# EAGLE schematic Spresense_PLC _V1 (EAGLE 9.6.2)
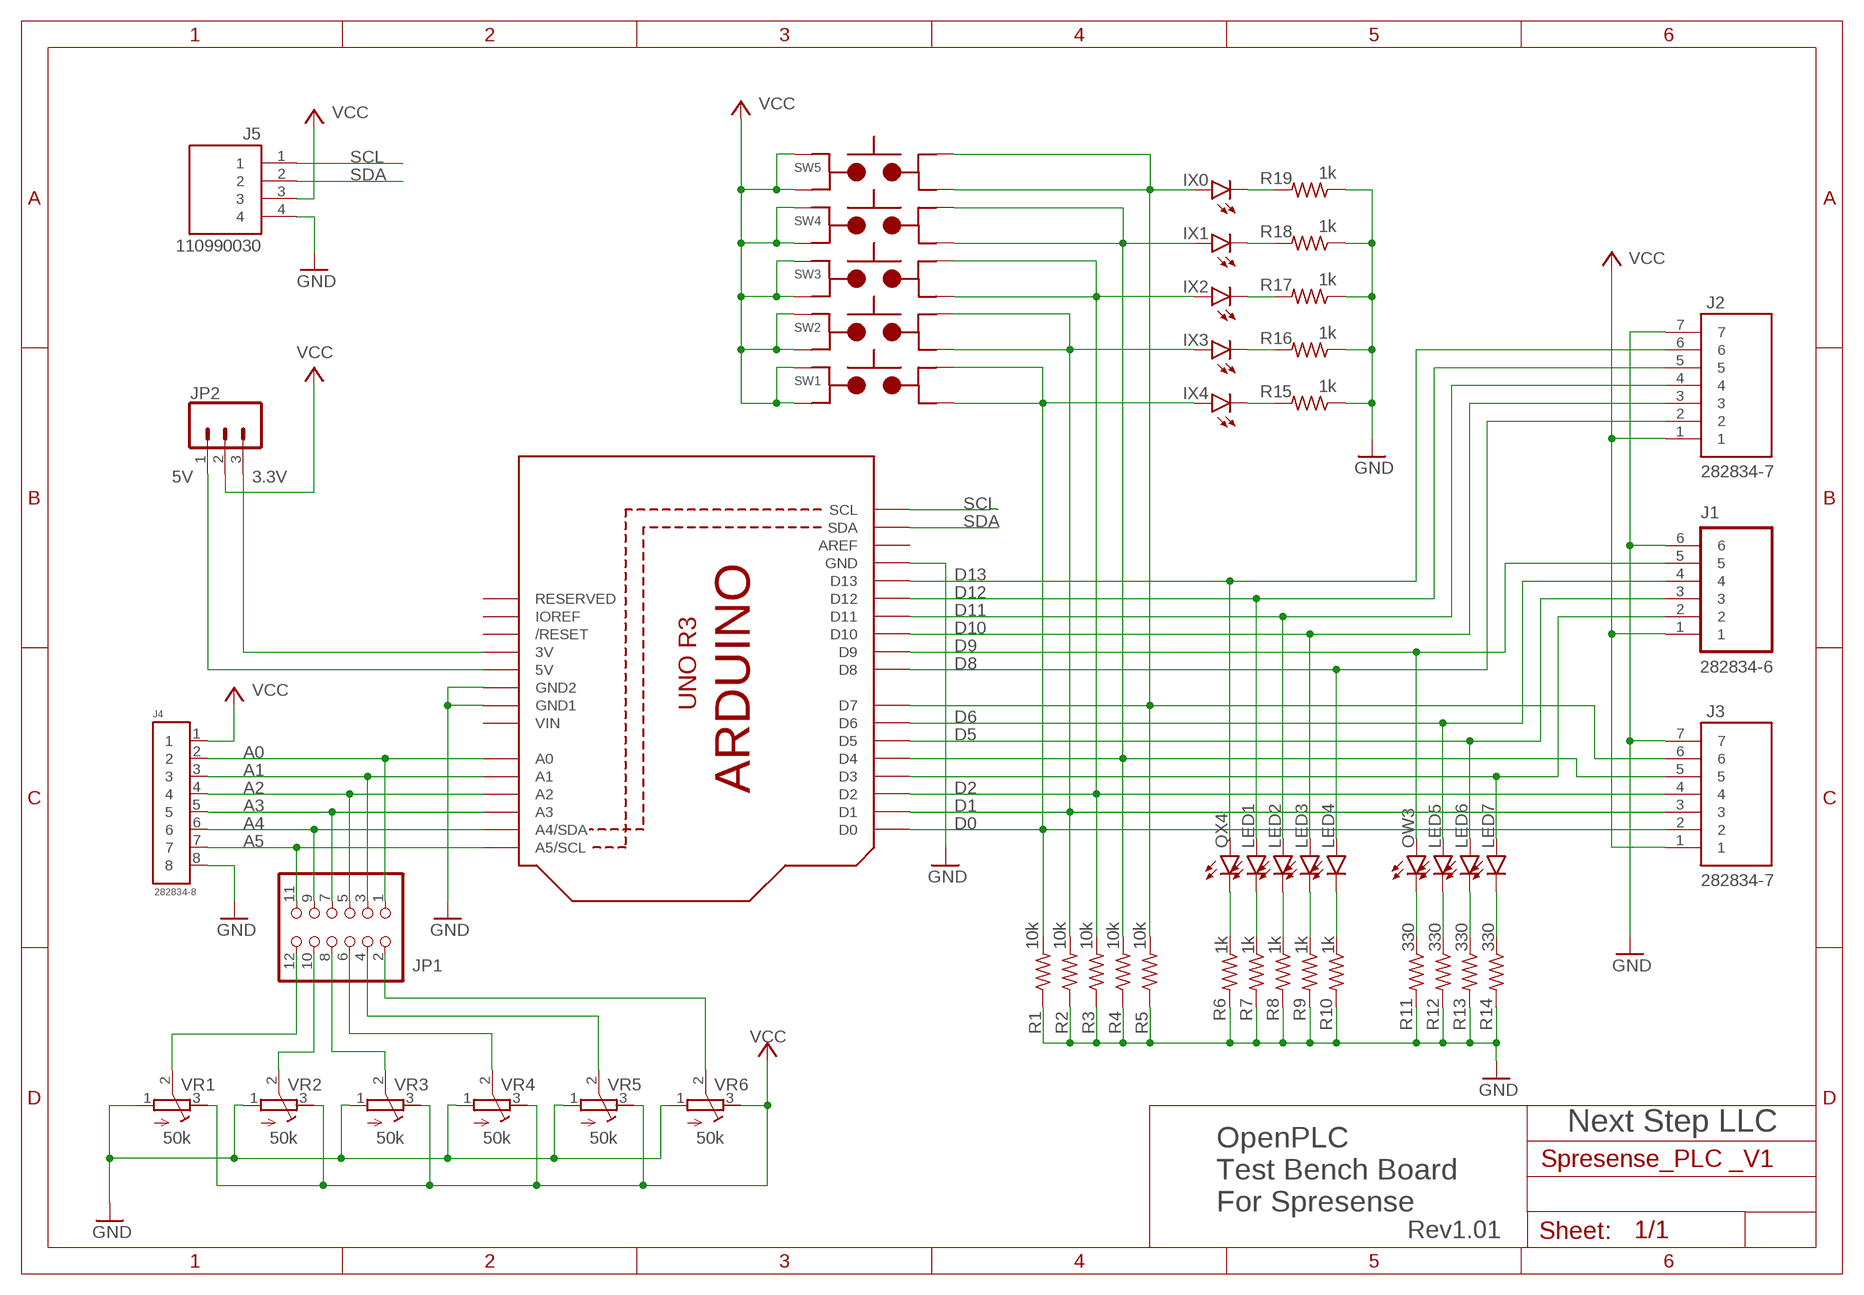
[diagram p0: schematic, sheet 1]

## Parts
IX0  LEDCHIP-LED0603  [CHIP-LED0603]
IX1  LEDCHIP-LED0603  [CHIP-LED0603]
IX2  LEDCHIP-LED0603  [CHIP-LED0603]
IX3  LEDCHIP-LED0603  [CHIP-LED0603]
IX4  LEDCHIP-LED0603  [CHIP-LED0603]
J1  282834-6  [TE_282834-6]
J2  282834-7  [TE_282834-7]
J3  282834-7  [TE_282834-7]
J4  282834-8  [HDRV8W85P254_8X1_2078X650X1000]
J5  110990030  [SEEED_110990030]
JP1  PINHD-2X6  [2X06]
JP2  455-1750-1-ND  CONN_03  [1X03]
LED1  LEDCHIP-LED0603  [CHIP-LED0603]
LED2  LEDCHIP-LED0603  [CHIP-LED0603]
LED3  LEDCHIP-LED0603  [CHIP-LED0603]
LED4  LEDCHIP-LED0603  [CHIP-LED0603]
LED5  LEDCHIP-LED0603  [CHIP-LED0603]
LED6  LEDCHIP-LED0603  [CHIP-LED0603]
LED7  LEDCHIP-LED0603  [CHIP-LED0603]
OW3  LEDCHIP-LED0603  [CHIP-LED0603]
QX4  LEDCHIP-LED0603  [CHIP-LED0603]
R1  10k  R-US_R0603  [R0603]
R2  10k  R-US_R0603  [R0603]
R3  10k  R-US_R0603  [R0603]
R4  10k  R-US_R0603  [R0603]
R5  10k  R-US_R0603  [R0603]
R6  1k  R-US_R0603  [R0603]
R7  1k  R-US_R0603  [R0603]
R8  1k  R-US_R0603  [R0603]
R9  1k  R-US_R0603  [R0603]
R10  1k  R-US_R0603  [R0603]
R11  330  R-US_R0603  [R0603]
R12  330  R-US_R0603  [R0603]
R13  330  R-US_R0603  [R0603]
R14  330  R-US_R0603  [R0603]
R15  1k  R-US_R0603  [R0603]
R16  1k  R-US_R0603  [R0603]
R17  1k  R-US_R0603  [R0603]
R18  1k  R-US_R0603  [R0603]
R19  1k  R-US_R0603  [R0603]
SW1  TL3342F160QG/TR  [SW_TL3342F160QG/TR]
SW2  TL3342F160QG/TR  [SW_TL3342F160QG/TR]
SW3  TL3342F160QG/TR  [SW_TL3342F160QG/TR]
SW4  TL3342F160QG/TR  [SW_TL3342F160QG/TR]
SW5  TL3342F160QG/TR  [SW_TL3342F160QG/TR]
U1  ARDUINOR3-DIMENSION  [ARDUINOR3]
VR1  50k  R-TRIMM3339P  [RTRIM3339P]
VR2  50k  R-TRIMM3339P  [RTRIM3339P]
VR3  50k  R-TRIMM3339P  [RTRIM3339P]
VR4  50k  R-TRIMM3339P  [RTRIM3339P]
VR5  50k  R-TRIMM3339P  [RTRIM3339P]
VR6  50k  R-TRIMM3339P  [RTRIM3339P]

## Nets
A0: J4.2 JP1.1 U1.A0
A1: J4.3 JP1.3 U1.A1
A2: J4.4 JP1.5 U1.A2
A3: J4.5 JP1.7 U1.A3
A4: J4.6 JP1.9 U1.A4(A4/SDA)
A5: J4.7 JP1.11 U1.A5(A5/SCL)
D0: IX4.A J3.2 R1.2 SW1.1 SW1.2 U1.D0
D1: IX3.A J3.3 R2.2 SW2.1 SW2.2 U1.D1
D2: IX2.A J3.4 R3.2 SW3.1 SW3.2 U1.D2
D5: IX1.A J3.5 R4.2 SW4.1 SW4.2 U1.D4
D6: IX0.A J3.6 R5.2 SW5.1 SW5.2 U1.D7
D8: J2.2 LED4.A U1.D8
D9: J1.5 OW3.A U1.D9
D10: J2.3 LED3.A U1.D10
D11: J2.4 LED2.A U1.D11
D12: J2.5 LED1.A U1.D12
D13: J2.6 QX4.A U1.D13
GND: J1.6 J2.7 J3.7 J4.8 J5.4 R1.1 R2.1 R3.1 R4.1 R5.1 R6.2 R7.2 R8.2 R9.2 R10.2 R11.2 R12.2 R13.2 R14.2 R15.1 R16.1 R17.1 R18.1 R19.1 U1.GND U1.GND1 U1.GND2 VR1.1(A) VR2.1(A) VR3.1(A) VR4.1(A) VR5.1(A) VR6.1(A)
N$1: LED1.C R7.1
N$2: LED2.C R8.1
N$3: LED3.C R9.1
N$4: LED4.C R10.1
N$5: LED5.C R12.1
N$6: LED6.C R13.1
N$7: LED7.C R14.1
N$8: JP1.12 VR1.2(S)
N$9: JP1.10 VR2.2(S)
N$10: JP1.8 VR3.2(S)
N$11: JP1.6 VR4.2(S)
N$12: JP1.4 VR5.2(S)
N$13: JP1.2 VR6.2(S)
N$14: JP2.3 U1.3V
N$15: J1.2 LED7.A U1.D3
N$16: JP2.1 U1.5V
N$17: IX0.C R19.2
N$18: IX1.C R18.2
N$19: IX2.C R17.2
N$20: IX3.C R16.2
N$21: IX4.C R15.2
N$22: J1.3 LED6.A U1.D5
N$23: J1.4 LED5.A U1.D6
N$25: OW3.C R11.1
N$26: QX4.C R6.1
SCL: J5.1 U1.SCL
SDA: J5.2 U1.SDA
VCC: J1.1 J2.1 J3.1 J4.1 J5.3 JP2.2 SW1.3 SW1.4 SW2.3 SW2.4 SW3.3 SW3.4 SW4.3 SW4.4 SW5.3 SW5.4 VR1.3(E) VR2.3(E) VR3.3(E) VR4.3(E) VR5.3(E) VR6.3(E)
Unconnected: U1.AREF U1.IOREF U1.RESERVED U1.RESET(/RESET)

## Notes on the sheet
- 5V | 3.3V
- Next Step LLC
- OpenPLC
  Test Bench Board
  For Spresense
- Rev1.01

## Power pins joined to a net without a drawn wire
VIN: U1.VIN

## Library data of the parts
IX0 IX1-IX4 LED1-LED7 OW3 QX4 = led:LED: LED OSRAM: - CHIPLED LG R971, LG N971, LY N971, LG Q971, LY Q971, LO R971, LY R971 LH N974, LH R974 LS Q976, LO Q976, LY Q976 LO Q996 - Hyper CHIPLED LW Q18S LB Q993, LB Q99A, LB R99A - SideLED LS A670, LO A670, LY A670, LG A670, LP A670 LB A673, LV A673, LT A673, LW A673 LH A674 LY A675 LS A676, LA A676, LO A676, LY A676, LW A676 LS A679, LY A679, LG A679 - Hyper Micro SIDELED® LS Y876, LA Y876, LO Y876, LY Y876 LT Y87S - SmartLED LW L88C, LW L88S LB L89C, LB L89S, LG L890 LS L89K, LO L89K, LY L89K LS L896, LA L896, LO L896, LY L896 - TOPLED LS T670, LO T670, LY T670, LG T670, LP T670 LSG T670, LSP T670, LSY T670, LOP T670, LYG T670 LG T671, LOG T671, LSG T671 LB T673, LV T673, LT T673, LW T673 LH T674 LS T676, LA T676, LO T676, LY T676, LB T676, LH T676, LSB T676, LW T676 LB T67C, LV T67C, LT T67C, LS T67K, LO T67K, LY T67K, LW E67C LS E67B, LA E67B, LO E67B, LY E67B, LB E67C, LV E67C, LT E67C LW T67C LS T679, LY T679, LG T679 LS T770, LO T770, LY T770, LG T770, LP T770 LB T773, LV T773, LT T773, LW T773 LH T774 LS E675, LA E675, LY E675, LS T675 LS T776, LA T776, LO T776, LY T776, LB T776 LHGB T686 LT T68C, LB T68C - Hyper Mini TOPLED® LB M676 - Mini TOPLED Santana® LG M470 LS M47K, LO M47K, LY M47K Source: http://www.osram.convergy.de LUXEON: - LUMILED® LXK2-PW12-R00, LXK2-PW12-S00, LXK2-PW14-U00, LXK2-PW14-V00 LXK2-PM12-R00, LXK2-PM12-S00, LXK2-PM14-U00 LXK2-PE12-Q00, LXK2-PE12-R00, LXK2-PE12-S00, LXK2-PE14-T00, LXK2-PE14-U00 LXK2-PB12-K00, LXK2-PB12-L00, LXK2-PB12-M00, LXK2-PB14-N00, LXK2-PB14-P00, LXK2-PB14-Q00 LXK2-PR12-L00, LXK2-PR12-M00, LXK2-PR14-Q00, LXK2-PR14-R00 LXK2-PD12-Q00, LXK2-PD12-R00, LXK2-PD12-S00 LXK2-PH12-R00, LXK2-PH12-S00 LXK2-PL12-P00, LXK2-PL12-Q00, LXK2-PL12-R00 Source: www.luxeon.com KINGBRIGHT: KA-3528ASYC Source: www.kingbright.com
J1 = 282834-6:282834-6: TERM BLOCK 6POS SIDE ENT 2.54MM Check availability <https://pricing.snapeda.com/parts/282834-6/TE%20Connectivity/view-part?ref=eda>; AVAILABILITY: In Stock; COMMENT: 282834-6; DESCRIPTION: Wire-To-Board Terminal Block, 6, 150 V, 10 A, 30 Awg, 16 Awg, 1.4 Mm; EU_ROHS_COMPLIANCE: Compliant with Exemptions; MF: TE Connectivity; MP: 282834-6; PACKAGE: None; PRICE: None; PURCHASE-URL: https://pricing.snapeda.com/search/part/282834-6/?ref=eda
J2 J3 = 282834-7:282834-7: Check availability <https://pricing.snapeda.com/parts/282834-7/TE%20Connectivity/view-part?ref=eda>; AVAILABILITY: In Stock; COMMENT: 282834-7; DESCRIPTION: TERMI-BLOK PCB MOUNT, 90 7P.; EU_ROHS_COMPLIANCE: Compliant with Exemptions; MF: TE Connectivity; MP: 282834-7; PACKAGE: None; PRICE: None; PURCHASE-URL: https://pricing.snapeda.com/search/part/282834-7/?ref=eda
J4 = 282834-8:282834-8: Screw terminal 1.4 mm² Number of pins 8 282834-8 TE Connectivity Green 1 pc(s) Check availability <https://pricing.snapeda.com/parts/282834-8/TE%20Connectivity/view-part?ref=eda>; AVAILABILITY: In Stock; COMMENT: 282834-8; DESCRIPTION: Buchanan; Conn; Term Blk; PCB; 8; 2.54mm; Front; 30-16 AWG; Green; 10 A; 150 V; EU_ROHS_COMPLIANCE: Compliant with Exemptions; MF: TE Connectivity; MP: 282834-8; PACKAGE: None; PRICE: None; PURCHASE-URL: https://pricing.snapeda.com/search/part/282834-8/?ref=eda
J5 = 110990030:110990030: Check prices <https://pricing.snapeda.com/parts/110990030/Seeed%20Technology%20Co.%2C%20Ltd/view-part?ref=eda>; AVAILABILITY: Good; DESCRIPTION: GROVE 2MM 4PIN VERT CONN 10PCS; MF: Seeed Technology Co., Ltd; MP: 110990030; PACKAGE: None; PRICE: None; PURCHASE-URL: https://pricing.snapeda.com/search/part/110990030/?ref=eda
JP1 = pinhead:PINHD-2X6: PIN HEADER
JP2 = SparkFun-Connectors:CONN_03: Multi connection point. Often used as Generic Header-pin footprint for 0.1 inch spaced/style header connections On any of the 0.1 inch spaced packages, you can populate with these: Break Away Headers - Straight <https://www.sparkfun.com/products/116> (PRT-00116) Break Away Male Headers - Right Angle <https://www.sparkfun.com/products/553> (PRT-00553) Female Headers <https://www.sparkfun.com/products/115> (PRT-00115) Break Away Headers - Machine Pin <https://www.sparkfun.com/products/117> (PRT-00117) Break Away Female Headers - Swiss Machine Pin <https://www.sparkfun.com/products/743> (PRT-00743) Stackable Header - 3 Pin (Female, 0.1") <https://www.sparkfun.com/products/13875> (PRT-13875) For SCREWTERMINALS and SPRING TERMINALS visit here: Screw Terimnals on SparkFun.com <https://www.sparkfun.com/search/results?term=Screw+Terminals> (5mm/3.5mm/2.54mm spacing) This device is also useful as a general connection point to wire up your design to another part of your project. Our various solder wires solder well into these plated through hole pads. Hook-Up Wire - Assortment (Stranded, 22 AWG) <https://www.sparkfun.com/products/11375> (PRT-11375) Hook-Up Wire - Assortment (Solid Core, 22 AWG) <https://www.sparkfun.com/products/11367> (PRT-11367) View the entire wire category on our website here <https://www.sparkfun.com/categories/141> Special notes: Molex polarized connector foot print use with SKU : PRT-08232 with associated crimp pins and housings.; PROD_ID: XXX-00000
R1-R19 = rcl:R-US_: RESISTOR, American symbol; SPICEPREFIX: R
SW1-SW5 = TL3342F160QG_TR:TL3342F160QG/TR: TL3342 Series SPST 1.6 N Round Button Gull Wing Surface Mount Tactile Switch Check availability <https://pricing.snapeda.com/parts/TL3342F160QG/TR/E-Switch/view-part?ref=eda>; AVAILABILITY: In Stock; DESCRIPTION: Tactile Switch SPST-NO Top Actuated Surface Mount; MF: E-Switch; MP: TL3342F160QG/TR; PACKAGE: None; PRICE: None; PURCHASE-URL: https://pricing.snapeda.com/search/part/TL3342F160QG/TR/?ref=eda
U1 = adafruit:ARDUINOR3: This is a new object for the new Arduino R3 - with extra pins that you may want to use (such as IOref, and duplicated A4/A5
VR1-VR6 = rcl:R-TRIMM: Trimm resistor; SPICEMODEL: X; SPICEPREFIXL: POT